# EAGLE schematic PHR_revA (EAGLE 6.4)
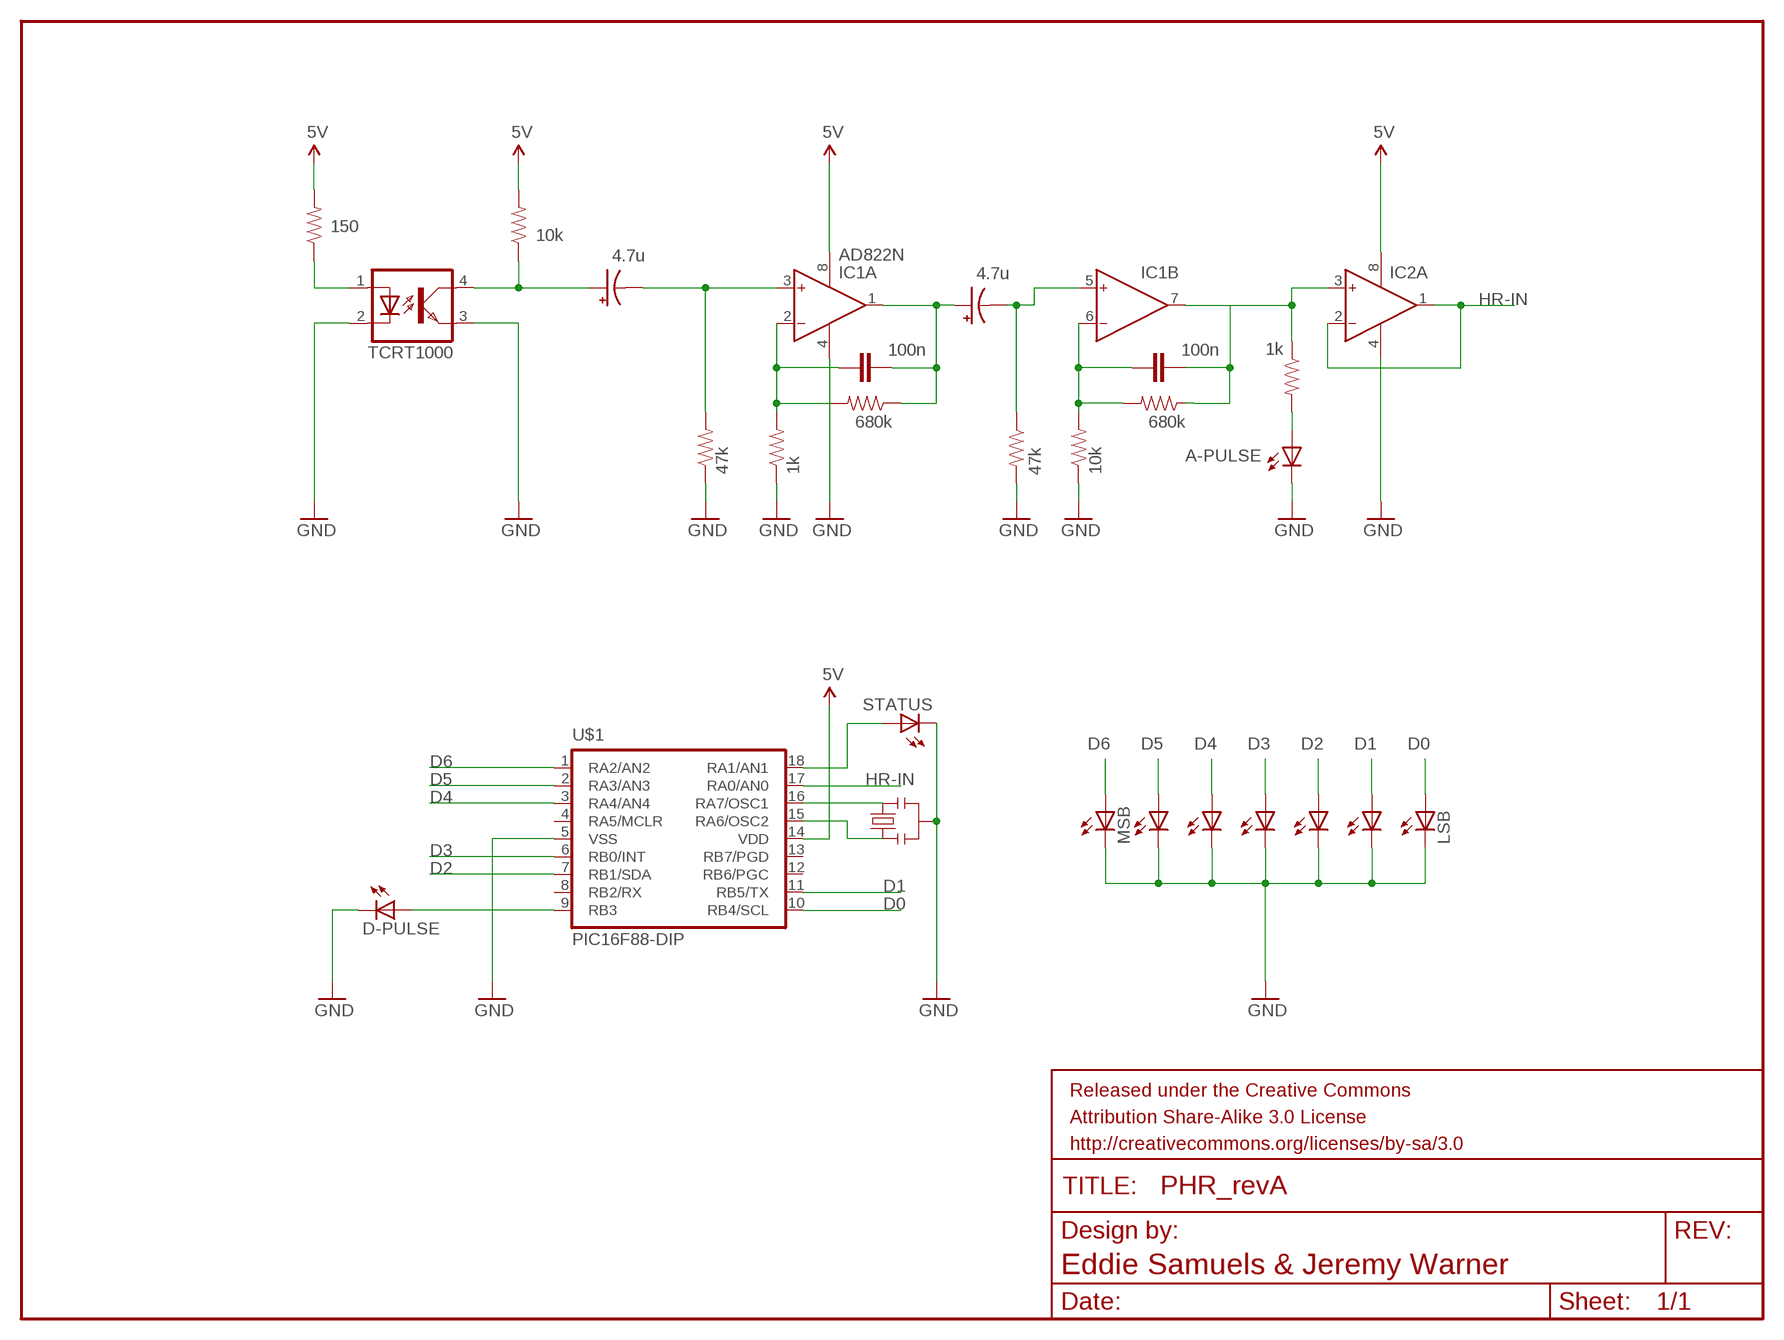
[diagram p0: schematic, sheet 1]

## Parts
A-PULSE  LED3MM  [LED3MM]
C1  100n  CAPKIT  [CAP-PTH-SMALL-KIT]
C2  100n  CAPKIT  [CAP-PTH-SMALL-KIT]
C3  4.7u  CAP_POLPTH2  [CPOL-RADIAL-10UF-25V]
C4  4.7u  CAP_POLPTH2  [CPOL-RADIAL-10UF-25V]
D1  LED3MM  [LED3MM]
D2  LED3MM  [LED3MM]
D3  LED3MM  [LED3MM]
D4  LED3MM  [LED3MM]
D5  LED3MM  [LED3MM]
D-PULSE  LED3MM  [LED3MM]
FRAME1  FRAME-LETTER  [CREATIVE_COMMONS]
IC1  AD822N  [DIL08]
IC2  AD822N  [DIL08]
LSB  LED3MM  [LED3MM]
MSB  LED3MM  [LED3MM]
OK1  SFH618A-2  [DIP4]
R1  47k  RESISTORPTH-1/4W  [AXIAL-0.4]
R2  1k  RESISTORPTH-1/4W  [AXIAL-0.4]
R3  680k  RESISTORPTH-1/4W  [AXIAL-0.4]
R4  47k  RESISTORPTH-1/4W  [AXIAL-0.4]
R5  10k  RESISTORPTH-1/4W  [AXIAL-0.4]
R6  680k  RESISTORPTH-1/4W  [AXIAL-0.4]
R7  10k  RESISTORPTH-1/4W  [AXIAL-0.4]
R8  150  RESISTORPTH-1/4W  [AXIAL-0.4]
R9  1k  RESISTORPTH-1/4W  [AXIAL-0.4]
STATUS  LED3MM  [LED3MM]
U$1  PIC16F88-DIP  [DIL18]
Y1  RESONATORPTH  [RESONATOR-PTH]

## Nets
5V: IC1.8(P:V+) IC2.8(P:V+) R7.P$2 R8.P$2 U$1.14(VDD)
D0: LSB.A U$1.10(RB4/SCL)
D1: D5.A U$1.11(RB5/TX)
D2: D4.A U$1.7(RB1/SDA)
D3: D3.A U$1.6(RB0/INT)
D4: D2.A U$1.3(RA4/AN4)
D5: D1.A U$1.2(RA3/AN3)
D6: MSB.A U$1.1(RA2/AN2)
GND: A-PULSE.K(C) D1.K(C) D2.K(C) D3.K(C) D4.K(C) D5.K(C) D-PULSE.K(C) IC1.4(P:V-) IC2.4(P:V-) LSB.K(C) MSB.K(C) OK1.2(C) OK1.3(EMIT) R1.P$1 R2.P$1 R4.P$2 R5.P$1 STATUS.K(C) U$1.5(VSS) Y1.2
HR-IN: IC2.1(A:OUT) IC2.2(A:IN-) U$1.17(RA0/AN0)
N$1: C3.2(-) IC1.3(A:IN+) R1.P$2
N$2: C1.1 IC1.2(A:IN-) R2.P$2 R3.P$2
N$3: C1.2 C4.1(+) IC1.1(A:OUT) R3.P$1
N$4: C4.2(-) IC1.5(B:IN+) R4.P$1
N$5: C2.1 IC1.6(B:IN-) R5.P$2 R6.P$2
N$6: C2.2 IC1.7(B:OUT) IC2.3(A:IN+) R6.P$1 R9.P$1
N$7: D-PULSE.A U$1.9(RB3)
N$8: C3.1(+) OK1.4(COL) R7.P$1
N$9: OK1.1(A) R8.P$1
N$10: U$1.16(RA7/OSC1) Y1.3
N$11: U$1.15(RA6/OSC2) Y1.1
N$12: A-PULSE.A R9.P$2
N$13: STATUS.A U$1.18(RA1/AN1)
Unconnected: IC2.5(B:IN+) IC2.6(B:IN-) IC2.7(B:OUT) U$1.4(RA5/MCLR) U$1.8(RB2/RX) U$1.12(RB6/PGC) U$1.13(RB7/PGD)

## Notes on the sheet
- TCRT1000
- Eddie Samuels & Jeremy Warner

## Library data of the parts
A-PULSE D1-D5 D-PULSE LSB MSB STATUS = adafruit:LED: LED OSRAM: - CHIPLED LG R971, LG N971, LY N971, LG Q971, LY Q971, LO R971, LY R971 LH N974, LH R974 LS Q976, LO Q976, LY Q976 LO Q996 - Hyper CHIPLED LW Q18S LB Q993, LB Q99A, LB R99A - SideLED LS A670, LO A670, LY A670, LG A670, LP A670 LB A673, LV A673, LT A673, LW A673 LH A674 LY A675 LS A676, LA A676, LO A676, LY A676, LW A676 LS A679, LY A679, LG A679 - Hyper Micro SIDELED® LS Y876, LA Y876, LO Y876, LY Y876 LT Y87S - SmartLED LW L88C, LW L88S LB L89C, LB L89S, LG L890 LS L89K, LO L89K, LY L89K LS L896, LA L896, LO L896, LY L896 - TOPLED LS T670, LO T670, LY T670, LG T670, LP T670 LSG T670, LSP T670, LSY T670, LOP T670, LYG T670 LG T671, LOG T671, LSG T671 LB T673, LV T673, LT T673, LW T673 LH T674 LS T676, LA T676, LO T676, LY T676, LB T676, LH T676, LSB T676, LW T676 LB T67C, LV T67C, LT T67C, LS T67K, LO T67K, LY T67K, LW E67C LS E67B, LA E67B, LO E67B, LY E67B, LB E67C, LV E67C, LT E67C LW T67C LS T679, LY T679, LG T679 LS T770, LO T770, LY T770, LG T770, LP T770 LB T773, LV T773, LT T773, LW T773 LH T774 LS E675, LA E675, LY E675, LS T675 LS T776, LA T776, LO T776, LY T776, LB T776 LHGB T686 LT T68C, LB T68C - Hyper Mini TOPLED® LB M676 - Mini TOPLED Santana® LG M470 LS M47K, LO M47K, LY M47K Source: http://www.osram.convergy.de/
C1 C2 = SparkFun-Capacitors:CAP: Capacitor Standard 0603 ceramic capacitor, and 0.1" leaded capacitor.
C3 C4 = SparkFun-Capacitors:CAP_POL: Capacitor Polarized These are standard SMD and PTH capacitors. Normally 10uF, 47uF, and 100uF in electrolytic and tantalum varieties. Always verify the external diameter of the through hole cap, it varies with capacity, voltage, and manufacturer. The EIA devices should be standard.
FRAME1 = SparkFun-Aesthetics:FRAME-LETTER: Schematic Frame Standard 8.5x11 US Letter frame
IC1 IC2 = analog-devices:AD822: Single-Supply, Rail-to-Rail Low Power FET-Input Op Amp Source: http://www.analog.com/static/imported-files/data_sheets/AD822.pdf; OC_FARNELL: 1438581; OC_NEWARK: unknown
OK1 = optocoupler:SFH618?*: Optocoupler, Phototransistor Output, Low Input Current Source: Data sheet <http://www.vishay.com/docs/83673/sfh618.pdf>; MF: VISHAY/TELEFUNKEN; MPN: SFH618A-2; OC_FARNELL: 6424855; OC_NEWARK: 21H7744
R1-R9 = SparkFun-Resistors:RESISTOR: Resistor Basic schematic elements and footprints for 0603, 1206, and PTH resistors.
U$1 = SparkFun-DigitalIC:PIC16F88-DIP: 8-bit PIC uC
Y1 = SparkFun-FreqCtrl:RESONATOR: Resonator Small SMD resonator. Used, eg, on the Arduino Pro/ Pro Mini boards. 8MHz- XTAL-08895 16MHz- XTAL-08900